# Altium schematic sheet eos26_motherboard_basic.SchDoc
size D
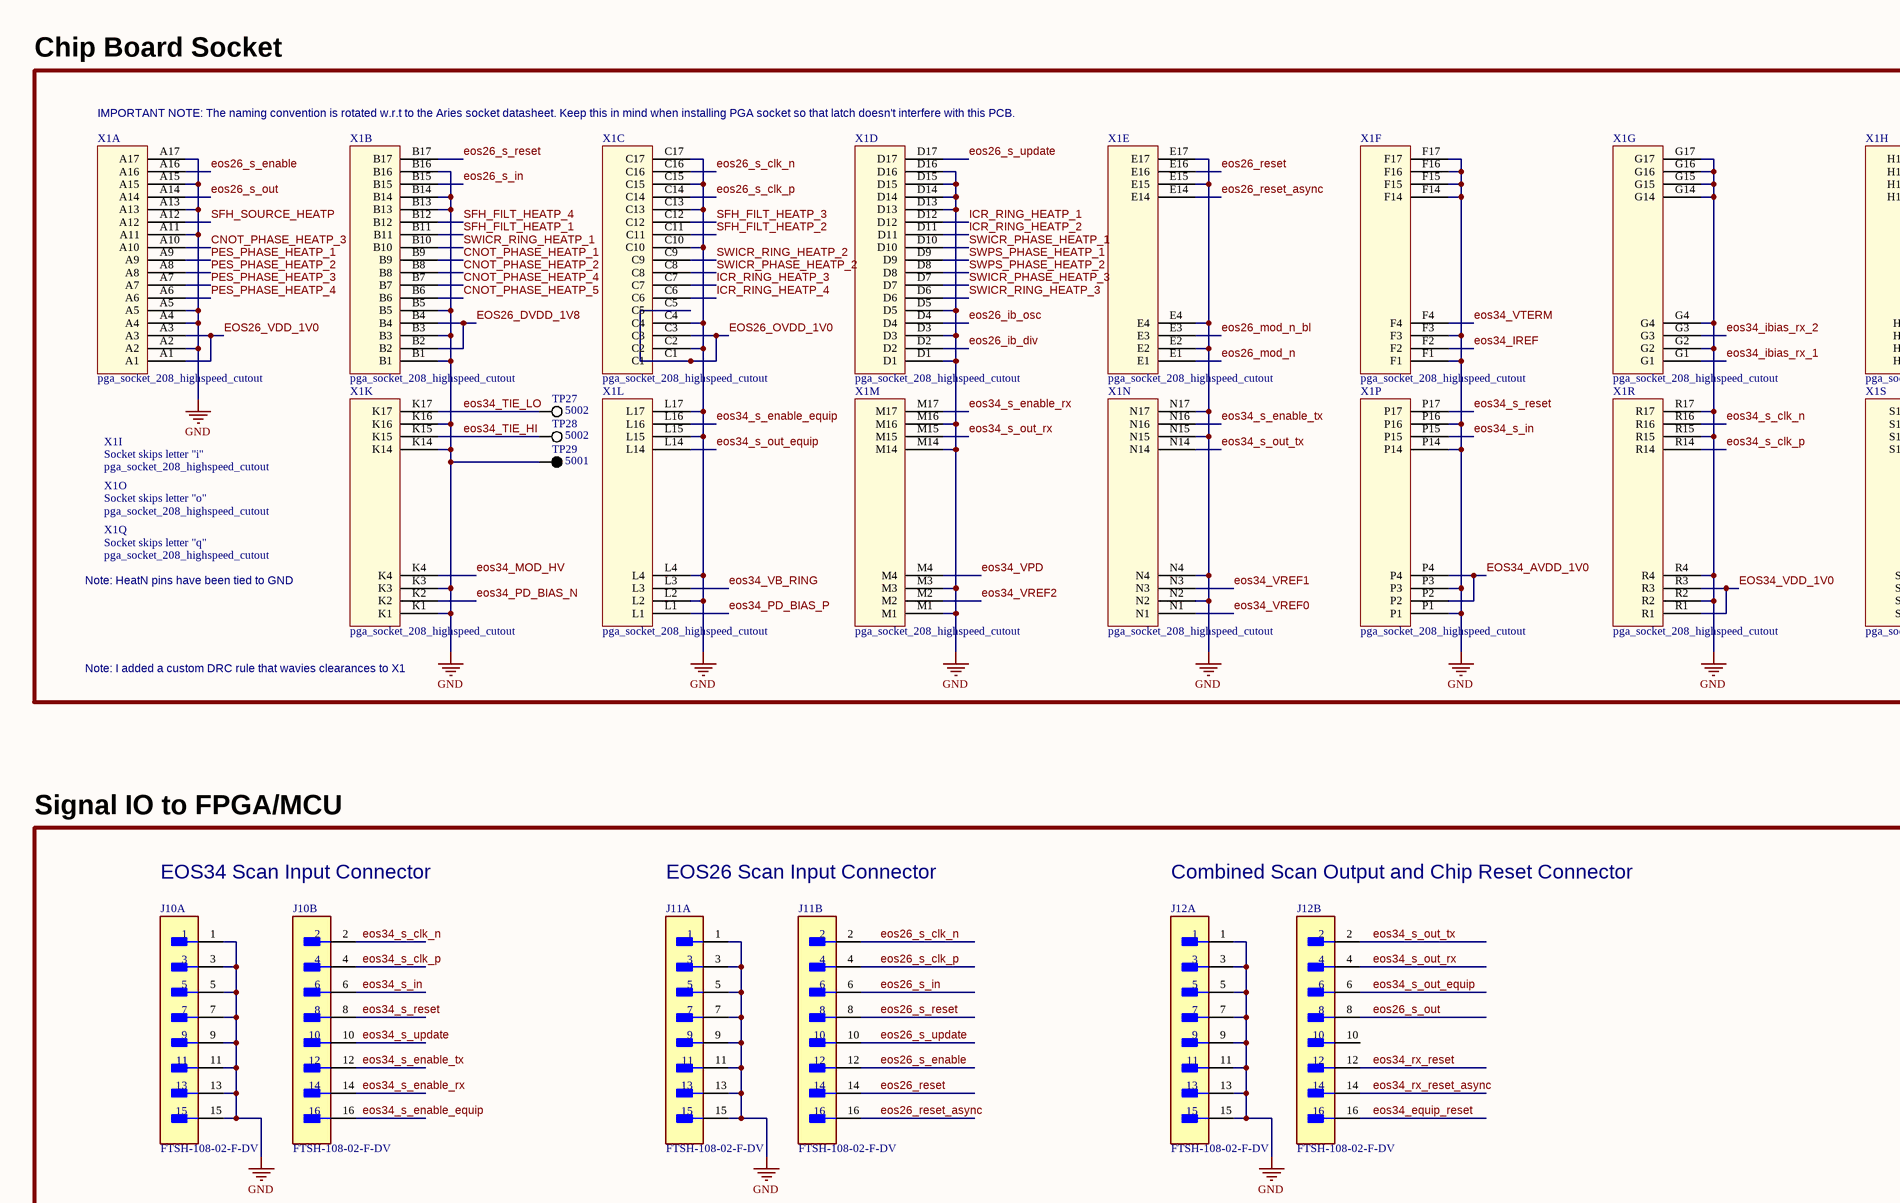
[diagram p0: eos26_motherboard_basic.SchDoc, top left]
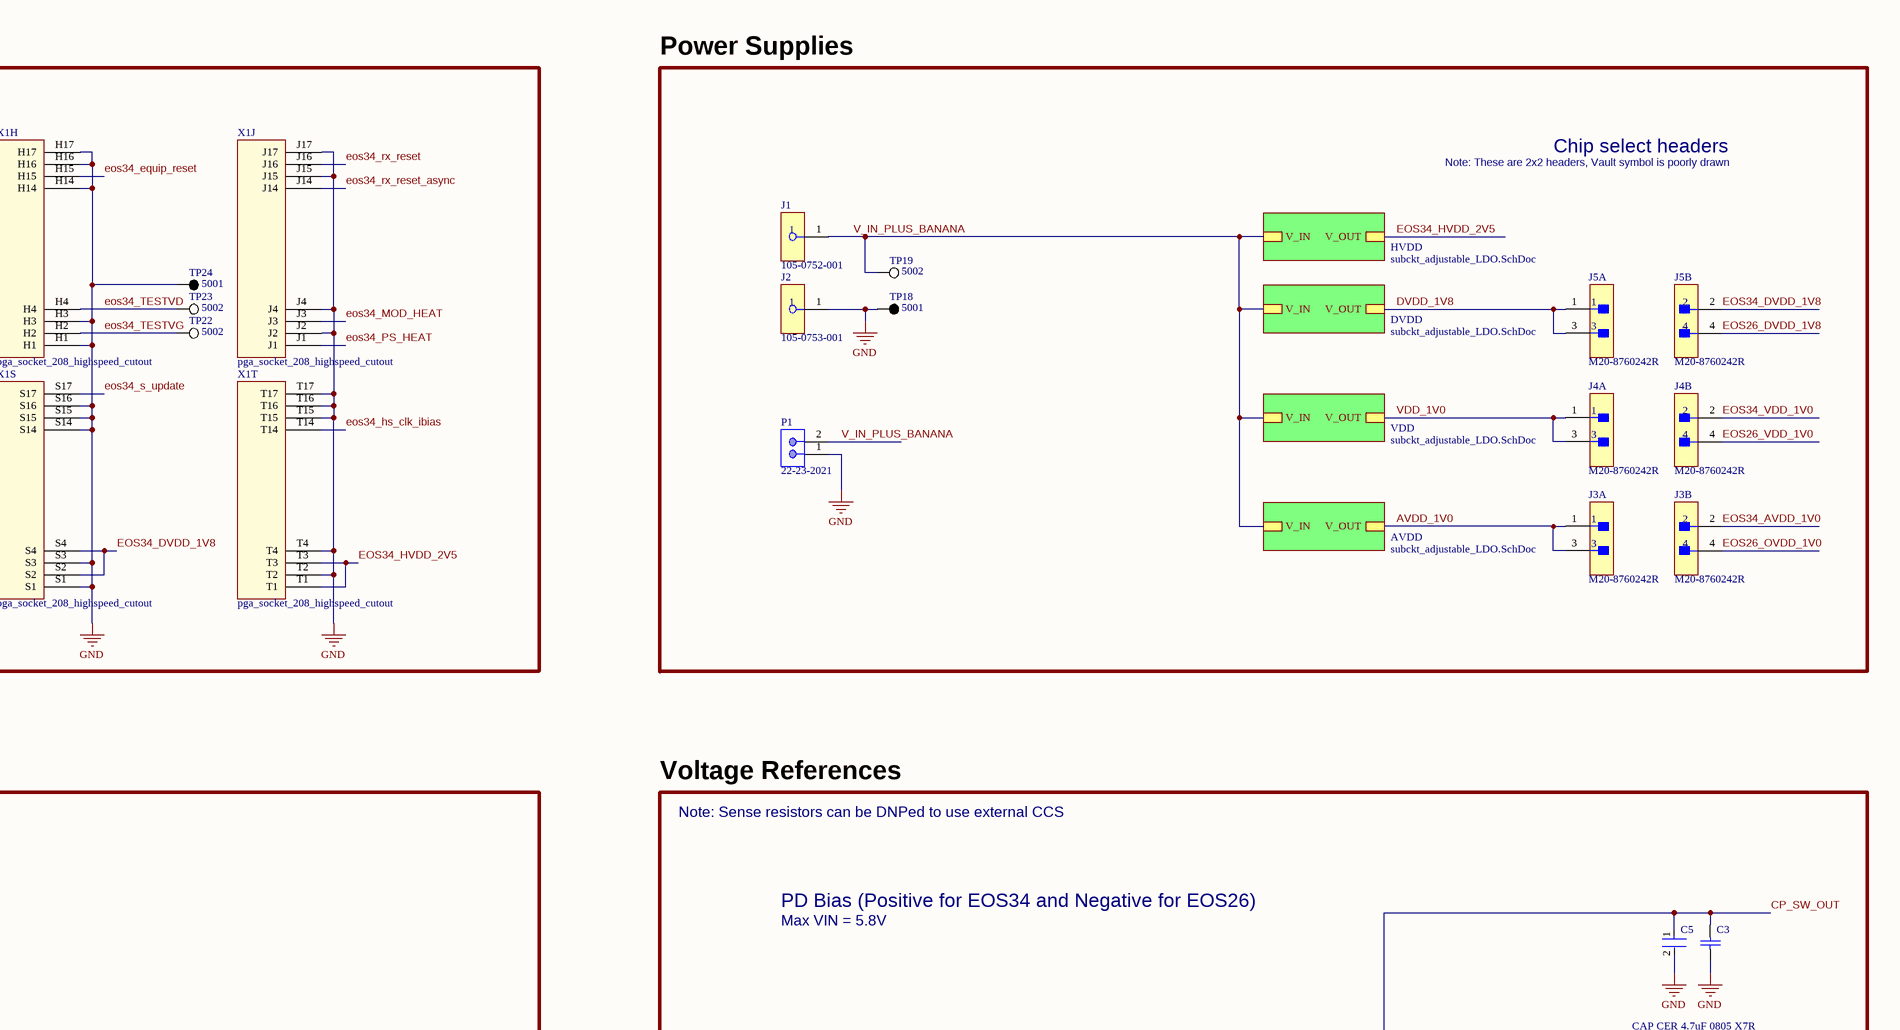
[diagram p1: eos26_motherboard_basic.SchDoc, top right]
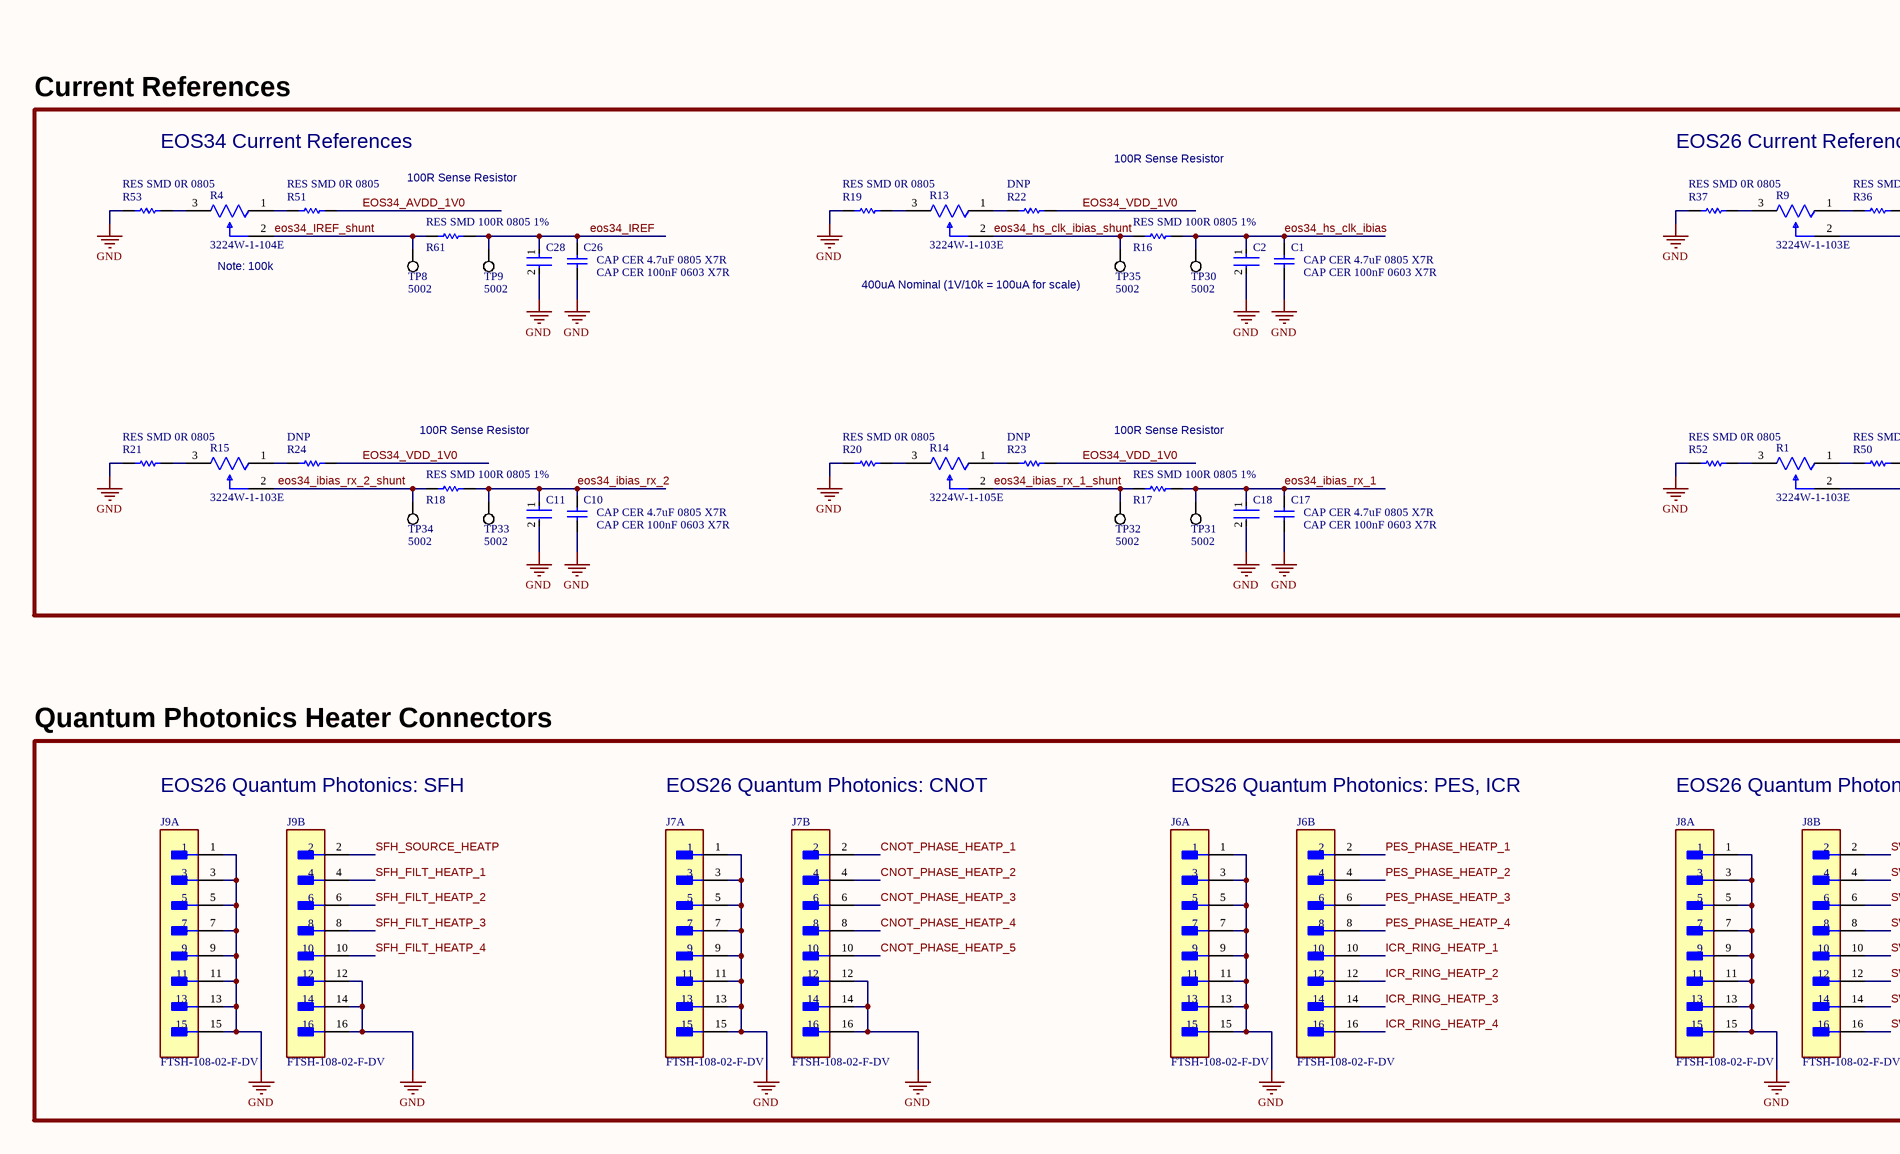
[diagram p2: eos26_motherboard_basic.SchDoc, bottom left]
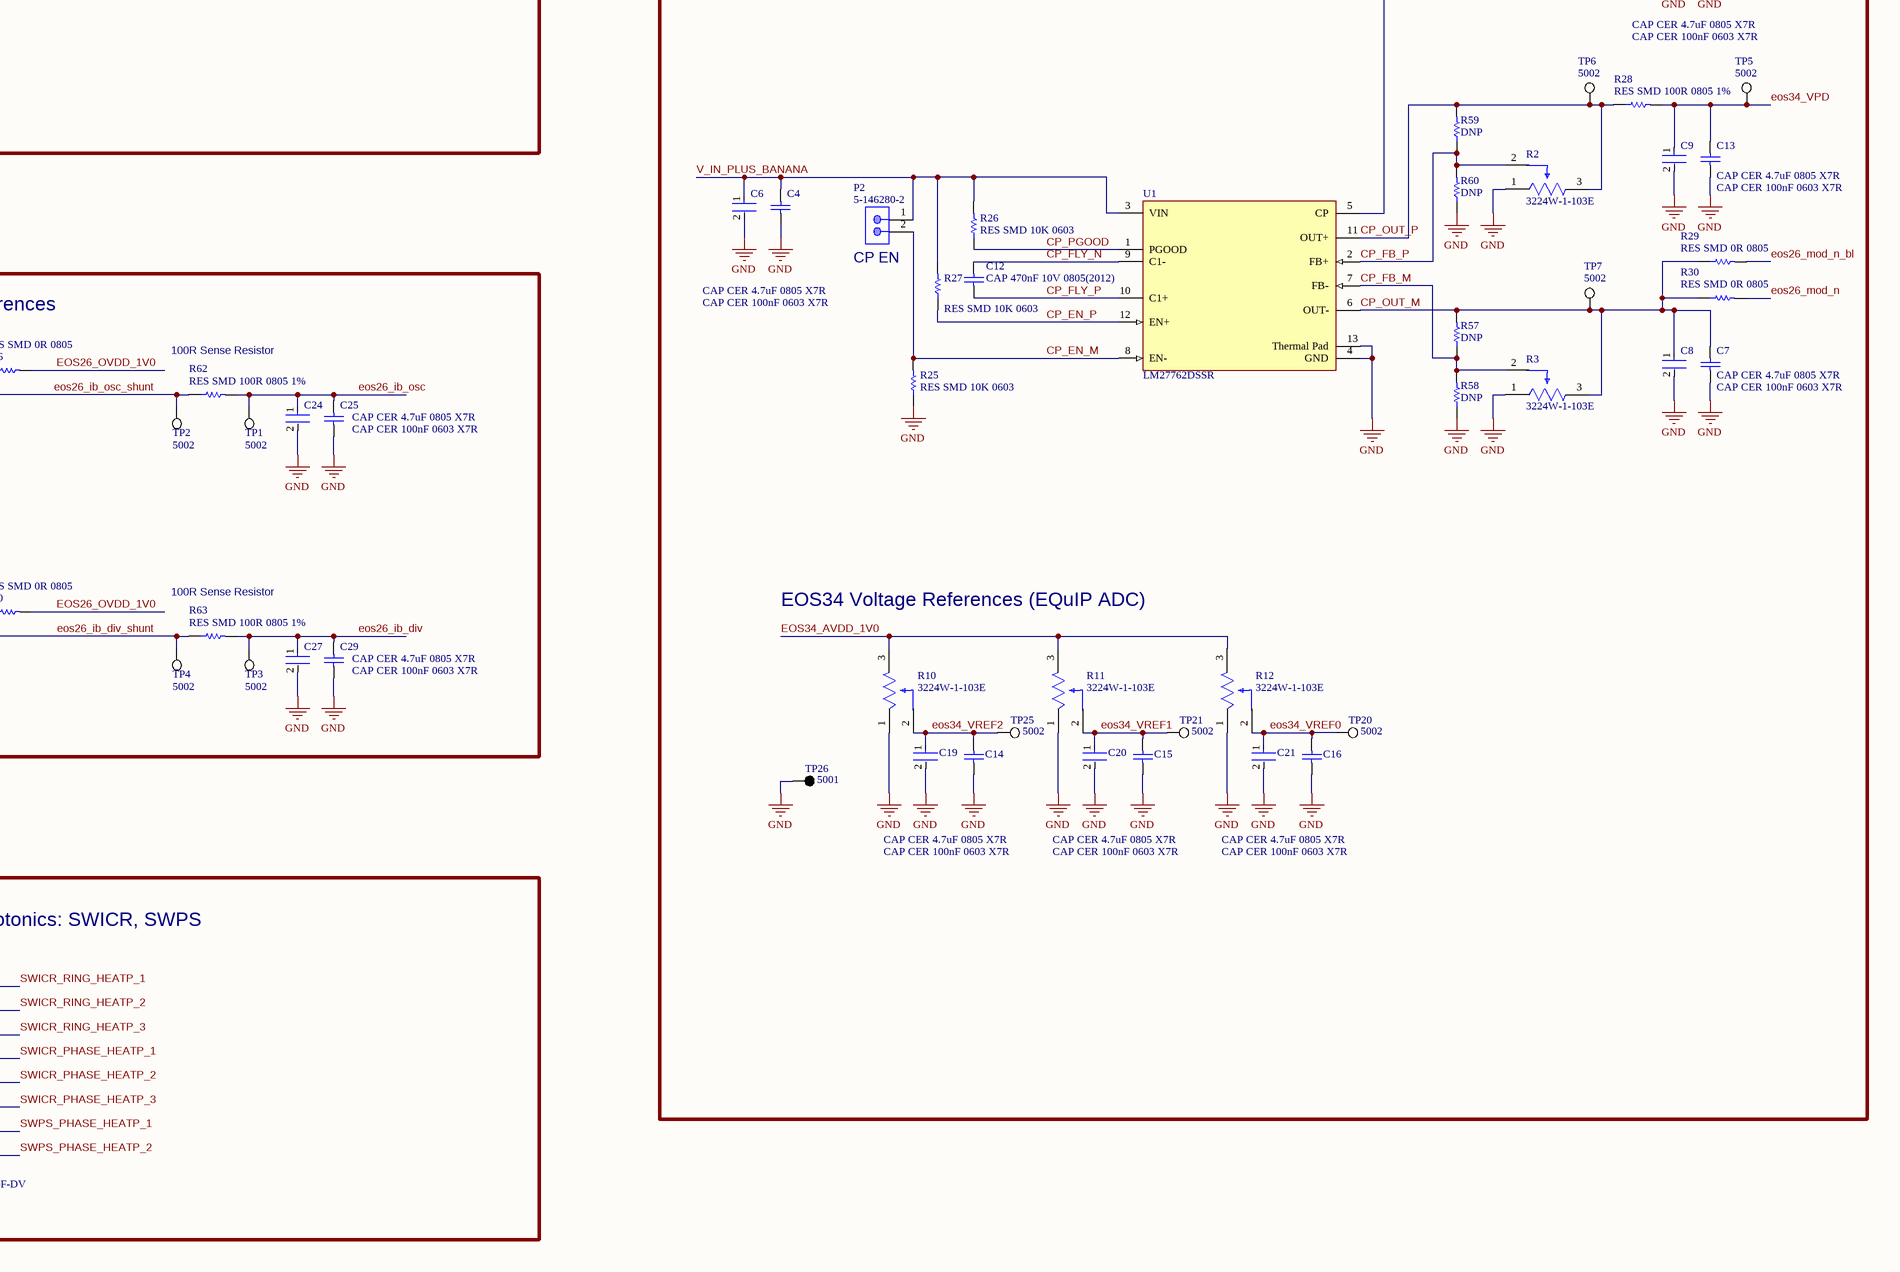
[diagram p3: eos26_motherboard_basic.SchDoc, bottom right]

## Parts
C1  CAP CER 4.7uF 0805 X7R  [CAPC2013X140X50NL20T25]
C2  CAP CER 100nF 0603 X7R  [FP-CC0603-DA-MFG]
C3  CAP CER 4.7uF 0805 X7R  [CAPC2013X140X50NL20T25]
C4  CAP CER 4.7uF 0805 X7R  [CAPC2013X140X50NL20T25]
C5  CAP CER 100nF 0603 X7R  [FP-CC0603-DA-MFG]
C6  CAP CER 100nF 0603 X7R  [FP-CC0603-DA-MFG]
C7  CAP CER 4.7uF 0805 X7R  [CAPC2013X140X50NL20T25]
C8  CAP CER 100nF 0603 X7R  [FP-CC0603-DA-MFG]
C9  CAP CER 100nF 0603 X7R  [FP-CC0603-DA-MFG]
C10  CAP CER 4.7uF 0805 X7R  [CAPC2013X140X50NL20T25]
C11  CAP CER 100nF 0603 X7R  [FP-CC0603-DA-MFG]
C12  CAP 470nF 10V 0805(2012)  [CAPC0805(2012)145_M]
C13  CAP CER 4.7uF 0805 X7R  [CAPC2013X140X50NL20T25]
C14  CAP CER 4.7uF 0805 X7R  [CAPC2013X140X50NL20T25]
C15  CAP CER 4.7uF 0805 X7R  [CAPC2013X140X50NL20T25]
C16  CAP CER 4.7uF 0805 X7R  [CAPC2013X140X50NL20T25]
C17  CAP CER 4.7uF 0805 X7R  [CAPC2013X140X50NL20T25]
C18  CAP CER 100nF 0603 X7R  [FP-CC0603-DA-MFG]
C19  CAP CER 100nF 0603 X7R  [FP-CC0603-DA-MFG]
C20  CAP CER 100nF 0603 X7R  [FP-CC0603-DA-MFG]
C21  CAP CER 100nF 0603 X7R  [FP-CC0603-DA-MFG]
C24  CAP CER 100nF 0603 X7R  [FP-CC0603-DA-MFG]
C25  CAP CER 4.7uF 0805 X7R  [CAPC2013X140X50NL20T25]
C26  CAP CER 4.7uF 0805 X7R  [CAPC2013X140X50NL20T25]
C27  CAP CER 100nF 0603 X7R  [FP-CC0603-DA-MFG]
C28  CAP CER 100nF 0603 X7R  [FP-CC0603-DA-MFG]
C29  CAP CER 4.7uF 0805 X7R  [CAPC2013X140X50NL20T25]
J1  105-0752-001  [FP-105-0751-001-MFG]
J2  105-0753-001  [FP-105-0751-001-MFG]
J3  M20-8760242R  [FP-M20-8760242R-MFG]  (parts A,B of 2)
J4  M20-8760242R  [FP-M20-8760242R-MFG]  (parts A,B of 2)
J5  M20-8760242R  [FP-M20-8760242R-MFG]  (parts A,B of 2)
J6  FTSH-108-02-F-DV  [LIBRARYSOURCE=Vault|VAULTGUID=B7D15EC3-160A-466F-A46C-7801FE6295A7|REVISIONGUID=4386816A-B426-492F-A73C-09950B70C106|FOOTPRINT=FP-FTSH-108-02-F-DV]  (parts A,B of 2)
J7  FTSH-108-02-F-DV  [LIBRARYSOURCE=Vault|VAULTGUID=B7D15EC3-160A-466F-A46C-7801FE6295A7|REVISIONGUID=4386816A-B426-492F-A73C-09950B70C106|FOOTPRINT=FP-FTSH-108-02-F-DV]  (parts A,B of 2)
J8  FTSH-108-02-F-DV  [LIBRARYSOURCE=Vault|VAULTGUID=B7D15EC3-160A-466F-A46C-7801FE6295A7|REVISIONGUID=4386816A-B426-492F-A73C-09950B70C106|FOOTPRINT=FP-FTSH-108-02-F-DV]  (parts A,B of 2)
J9  FTSH-108-02-F-DV  [LIBRARYSOURCE=Vault|VAULTGUID=B7D15EC3-160A-466F-A46C-7801FE6295A7|REVISIONGUID=4386816A-B426-492F-A73C-09950B70C106|FOOTPRINT=FP-FTSH-108-02-F-DV]  (parts A,B of 2)
J10  FTSH-108-02-F-DV  [LIBRARYSOURCE=Vault|VAULTGUID=B7D15EC3-160A-466F-A46C-7801FE6295A7|REVISIONGUID=4386816A-B426-492F-A73C-09950B70C106|FOOTPRINT=FP-FTSH-108-02-F-DV]  (parts A,B of 2)
J11  FTSH-108-02-F-DV  [LIBRARYSOURCE=Vault|VAULTGUID=B7D15EC3-160A-466F-A46C-7801FE6295A7|REVISIONGUID=4386816A-B426-492F-A73C-09950B70C106|FOOTPRINT=FP-FTSH-108-02-F-DV]  (parts A,B of 2)
J12  FTSH-108-02-F-DV  [LIBRARYSOURCE=Vault|VAULTGUID=B7D15EC3-160A-466F-A46C-7801FE6295A7|REVISIONGUID=4386816A-B426-492F-A73C-09950B70C106|FOOTPRINT=FP-FTSH-108-02-F-DV]  (parts A,B of 2)
P1  22-23-2021  [MOLX-22-23-2021_V]
P2  5-146280-2  [TECO-5-146280-2_V]
R1  3224W-1-103E  [FP-3224W-MFG]
R2  3224W-1-103E  [FP-3224W-MFG]
R3  3224W-1-103E  [FP-3224W-MFG]
R4  3224W-1-104E  [FP-3224W-MFG]
R9  3224W-1-103E  [FP-3224W-MFG]
R10  3224W-1-103E  [FP-3224W-MFG]
R11  3224W-1-103E  [FP-3224W-MFG]
R12  3224W-1-103E  [FP-3224W-MFG]
R13  3224W-1-103E  [FP-3224W-MFG]
R14  3224W-1-105E  [FP-3224W-MFG]
R15  3224W-1-103E  [FP-3224W-MFG]
R16  RES SMD 100R 0805 1%  [RESC2013X55X40NL15T20]
R17  RES SMD 100R 0805 1%  [RESC2013X55X40NL15T20]
R18  RES SMD 100R 0805 1%  [RESC2013X55X40NL15T20]
R19  RES SMD 0R 0805  [RESC2013X55X40NL15T20]
R20  RES SMD 0R 0805  [RESC2013X55X40NL15T20]
R21  RES SMD 0R 0805  [RESC2013X55X40NL15T20]
R22  DNP  [RESC2013X55X40NL15T20]
R23  DNP  [RESC2013X55X40NL15T20]
R24  DNP  [RESC2013X55X40NL15T20]
R25  RES SMD 10K 0603  [RESC1609X55X30LL15T15]
R26  RES SMD 10K 0603  [RESC1609X55X30LL15T15]
R27  RES SMD 10K 0603  [RESC1609X55X30LL15T15]
R28  RES SMD 100R 0805 1%  [RESC2013X55X40NL15T20]
R29  RES SMD 0R 0805  [RESC2013X55X40NL15T20]
R30  RES SMD 0R 0805  [RESC2013X55X40NL15T20]
R36  RES SMD 0R 0805  [RESC2013X55X40NL15T20]
R37  RES SMD 0R 0805  [RESC2013X55X40NL15T20]
R50  RES SMD 0R 0805  [RESC2013X55X40NL15T20]
R51  RES SMD 0R 0805  [RESC2013X55X40NL15T20]
R52  RES SMD 0R 0805  [RESC2013X55X40NL15T20]
R53  RES SMD 0R 0805  [RESC2013X55X40NL15T20]
R57  DNP  [RESC1608X55X30LL10T20_A]
R58  DNP  [RESC1608X55X30LL10T20_A]
R59  DNP  [RESC1608X55X30LL10T20_A]
R60  DNP  [RESC1608X55X30LL10T20_A]
R61  RES SMD 100R 0805 1%  [RESC2013X55X40NL15T20]
R62  RES SMD 100R 0805 1%  [RESC2013X55X40NL15T20]
R63  RES SMD 100R 0805 1%  [RESC2013X55X40NL15T20]
TP1  5002  [KSTN-5002]
TP2  5002  [KSTN-5002]
TP3  5002  [KSTN-5002]
TP4  5002  [KSTN-5002]
TP5  5002  [KSTN-5002]
TP6  5002  [KSTN-5002]
TP7  5002  [KSTN-5002]
TP8  5002  [KSTN-5002]
TP9  5002  [KSTN-5002]
TP18  5001  [KSTN-5001]
TP19  5002  [KSTN-5002]
TP20  5002  [KSTN-5002]
TP21  5002  [KSTN-5002]
TP22  5002  [KSTN-5002]
TP23  5002  [KSTN-5002]
TP24  5001  [KSTN-5001]
TP25  5002  [KSTN-5002]
TP26  5001  [KSTN-5001]
TP27  5002  [KSTN-5002]
TP28  5002  [KSTN-5002]
TP29  5001  [KSTN-5001]
TP30  5002  [KSTN-5002]
TP31  5002  [KSTN-5002]
TP32  5002  [KSTN-5002]
TP33  5002  [KSTN-5002]
TP34  5002  [KSTN-5002]
TP35  5002  [KSTN-5002]
U1  LM27762DSSR  [FP-DSS0012B-MFG]
X1  pga_socket_208_highspeed_cutout  [pga_socket_208pin_highspeed_cutout]  (parts A,B,C,D,E,F,G,H,I,J,K,L,M,N,O,P,Q,R,S,T of 20)

## Blocks framed on the sheet
Chip Board Socket: TP22-TP24 TP27-TP29 X1
Power Supplies: J1-J5 P1 TP18 TP19
Signal IO to FPGA/MCU: J10-J12
Voltage References: C3-C9 C12-C16 C19-C21 P2 R2 R3 R10-R12 R25-R30 R57-R60 TP5-TP7 TP20 TP21 TP25 TP26 U1
Current References: C1 C2 C10 C11 C17 C18 C24-C29 R1 R4 R9 R13-R24 R36 R37 R50-R53 R61-R63 TP1-TP4 TP8 TP9 TP30-TP35
Quantum Photonics Heater Connectors: J6-J9

## Sub-sheets
AVDD = subckt_adjustable_LDO.SchDoc: V_IN, V_OUT
DVDD = subckt_adjustable_LDO.SchDoc: V_IN, V_OUT
HVDD = subckt_adjustable_LDO.SchDoc: V_IN, V_OUT
VDD = subckt_adjustable_LDO.SchDoc: V_IN, V_OUT

## Nets
GND: C1.2 C2.2 C3.2 C4.2 C5.2 C6.2 C7.2 C8.2 C9.2 C10.2 C11.2 C13.2 C14.2 C15.2 C16.2 C17.2 C18.2 C19.2 C20.2 C21.2 C24.2 C25.2 C26.2 C27.2 C28.2 C29.2 J2.1 J6.1 J6.3 J6.5 J6.7 J6.9 J6.11 J6.13 J6.15 J7.1 J7.3 J7.5 J7.7 J7.9 J7.11 J7.12 J7.13 J7.14 J7.15 J7.16 J8.1 J8.3 J8.5 J8.7 J8.9 J8.11 J8.13 J8.15 J9.1 J9.3 J9.5 J9.7 J9.9 J9.11 J9.12 J9.13 J9.14 J9.15 J9.16 J10.1 J10.3 J10.5 J10.7 J10.9 J10.11 J10.13 J10.15 J11.1 J11.3 J11.5 J11.7 J11.9 J11.11 J11.13 J11.15 J12.1 J12.3 J12.5 J12.7 J12.9 J12.11 J12.13 J12.15 P1.1 R2.1(CCW) R3.1(CCW) R10.1(CCW) R11.1(CCW) R12.1(CCW) R19.1 R20.1 R21.1 R25.1 R37.1 R52.1 R53.1 R58.1 R60.1 TP18.1 TP24.1 TP26.1 TP29.1 U1.4(GND) U1.13(Thermal_Pad) X1.A2 X1.A4 X1.A5 X1.A11 X1.A13 X1.A15 X1.A17 X1.B1 X1.B3 X1.B5 X1.B13 X1.B14 X1.B16 X1.C2 X1.C4 X1.C10 X1.C13 X1.C15 X1.C17 X1.D1 X1.D3 X1.D5 X1.D13 X1.D14 X1.D15 X1.D16 X1.E2 X1.E4 X1.E15 X1.E17 X1.F1 X1.F3 X1.F14 X1.F15 X1.F16 X1.F17 X1.G2 X1.G4 X1.G14 X1.G15 X1.G16 X1.G17 X1.H1 X1.H3 X1.H14 X1.H16 X1.H17 X1.J2 X1.J4 X1.J15 X1.J17 X1.K1 X1.K3 X1.K14 X1.K16 X1.L2 X1.L4 X1.L15 X1.L17 X1.M1 X1.M3 X1.M14 X1.M16 X1.N2 X1.N4 X1.N15 X1.N17 X1.P1 X1.P3 X1.P14 X1.P16 X1.R2 X1.R4 X1.R15 X1.R17 X1.S1 X1.S3 X1.S14 X1.S15 X1.S16 X1.T2 X1.T4 X1.T15 X1.T16 X1.T17
AVDD_1V0: J3.1 J3.3 ; sheet AVDD/V_OUT
CNOT_PHASE_HEATP_1: J7.2 X1.B9
CNOT_PHASE_HEATP_2: J7.4 X1.B8
CNOT_PHASE_HEATP_3: J7.6 X1.A10
CNOT_PHASE_HEATP_4: J7.8 X1.B7
CNOT_PHASE_HEATP_5: J7.10 X1.B6
CP_EN_M: P2.2 R25.2 U1.8(EN-)
CP_EN_P: R27.1 U1.12(EN+)
CP_FB_M: R3.2(WIPER) R57.1 R58.2 U1.7(FB-)
CP_FB_P: R2.2(WIPER) R59.1 R60.2 U1.2(FB+)
CP_FLY_N: C12.2 U1.9(C1-)
CP_FLY_P: C12.1 U1.10(C1+)
CP_OUT_M: C7.1 C8.1 R3.3(CW) R29.1 R30.1 R57.2 TP7.1 U1.6(OUT-)
CP_OUT_P: R2.3(CW) R28.1 R59.2 TP6.1 U1.11(OUT+)
CP_PGOOD: R26.1 U1.1(PGOOD)
CP_SW_OUT: C3.1 C5.1 U1.5(CP)
DVDD_1V8: J5.1 J5.3 ; sheet DVDD/V_OUT
EOS26_DVDD_1V8: J5.4 X1.B2 X1.B4
eos26_ib_div: C27.1 C29.1 R63.2 TP3.1 X1.D2
eos26_ib_div_shunt: R1.2(WIPER) R63.1 TP4.1
eos26_ib_osc: C24.1 C25.1 R62.2 TP1.1 X1.D4
eos26_ib_osc_shunt: R9.2(WIPER) R62.1 TP2.1
eos26_mod_n: R30.2 X1.E1
eos26_mod_n_bl: R29.2 X1.E3
EOS26_OVDD_1V0: J3.4 R36.2 R50.2 X1.C1 X1.C3 X1.C5
eos26_reset: J11.14 X1.E16
eos26_reset_async: J11.16 X1.E14
eos26_s_clk_n: J11.2 X1.C16
eos26_s_clk_p: J11.4 X1.C14
eos26_s_enable: J11.12 X1.A16
eos26_s_in: J11.6 X1.B15
eos26_s_out: J12.8 X1.A14
eos26_s_reset: J11.8 X1.B17
eos26_s_update: J11.10 X1.D17
EOS26_VDD_1V0: J4.4 X1.A1 X1.A3
EOS34_AVDD_1V0: J3.2 R10.3(CW) R11.3(CW) R12.3(CW) R51.2 X1.P2 X1.P4
EOS34_DVDD_1V8: J5.2 X1.S2 X1.S4
eos34_equip_reset: J12.16 X1.H15
eos34_hs_clk_ibias: C1.1 C2.1 R16.2 TP30.1 X1.T14
eos34_hs_clk_ibias_shunt: R13.2(WIPER) R16.1 TP35.1
EOS34_HVDD_2V5: X1.T1 X1.T3 ; sheet HVDD/V_OUT
eos34_ibias_rx_1: C17.1 C18.1 R17.2 TP31.1 X1.G1
eos34_ibias_rx_1_shunt: R14.2(WIPER) R17.1 TP32.1
eos34_ibias_rx_2: C10.1 C11.1 R18.2 TP33.1 X1.G3
eos34_ibias_rx_2_shunt: R15.2(WIPER) R18.1 TP34.1
eos34_IREF: C26.1 C28.1 R61.2 TP9.1 X1.F2
eos34_IREF_shunt: R4.2(WIPER) R61.1 TP8.1
eos34_MOD_HEAT: X1.J3
eos34_MOD_HV: X1.K4
eos34_PD_BIAS_N: X1.K2
eos34_PD_BIAS_P: X1.L1
eos34_PS_HEAT: X1.J1
eos34_rx_reset: J12.12 X1.J16
eos34_rx_reset_async: J12.14 X1.J14
eos34_s_clk_n: J10.2 X1.R16
eos34_s_clk_p: J10.4 X1.R14
eos34_s_enable_equip: J10.16 X1.L16
eos34_s_enable_rx: J10.14 X1.M17
eos34_s_enable_tx: J10.12 X1.N16
eos34_s_in: J10.6 X1.P15
eos34_s_out_equip: J12.6 X1.L14
eos34_s_out_rx: J12.4 X1.M15
eos34_s_out_tx: J12.2 X1.N14
eos34_s_reset: J10.8 X1.P17
eos34_s_update: J10.10 X1.S17
eos34_TESTVD: TP23.1 X1.H4
eos34_TESTVG: TP22.1 X1.H2
eos34_TIE_HI: TP28.1 X1.K15
eos34_TIE_LO: TP27.1 X1.K17
eos34_VB_RING: X1.L3
EOS34_VDD_1V0: J4.2 R22.2 R23.2 R24.2 X1.R1 X1.R3
eos34_VPD: C9.1 C13.1 R28.2 TP5.1 X1.M4
eos34_VREF0: C16.1 C21.1 R12.2(WIPER) TP20.1 X1.N1
eos34_VREF1: C15.1 C20.1 R11.2(WIPER) TP21.1 X1.N3
eos34_VREF2: C14.1 C19.1 R10.2(WIPER) TP25.1 X1.M2
eos34_VTERM: X1.F4
ICR_RING_HEATP_1: J6.10 X1.D12
ICR_RING_HEATP_2: J6.12 X1.D11
ICR_RING_HEATP_3: J6.14 X1.C7
ICR_RING_HEATP_4: J6.16 X1.C6
PES_PHASE_HEATP_1: J6.2 X1.A9
PES_PHASE_HEATP_2: J6.4 X1.A8
PES_PHASE_HEATP_3: J6.6 X1.A7
PES_PHASE_HEATP_4: J6.8 X1.A6
SFH_FILT_HEATP_1: J9.4 X1.B11
SFH_FILT_HEATP_2: J9.6 X1.C11
SFH_FILT_HEATP_3: J9.8 X1.C12
SFH_FILT_HEATP_4: J9.10 X1.B12
SFH_SOURCE_HEATP: J9.2 X1.A12
SWICR_PHASE_HEATP_1: J8.8 X1.D10
SWICR_PHASE_HEATP_2: J8.10 X1.C8
SWICR_PHASE_HEATP_3: J8.12 X1.D7
SWICR_RING_HEATP_1: J8.2 X1.B10
SWICR_RING_HEATP_2: J8.4 X1.C9
SWICR_RING_HEATP_3: J8.6 X1.D6
SWPS_PHASE_HEATP_1: J8.14 X1.D9
SWPS_PHASE_HEATP_2: J8.16 X1.D8
V_IN_PLUS_BANANA: C4.1 C6.1 J1.1 P1.2 P2.1 R26.2 R27.2 TP19.1 U1.3(VIN) ; sheet DVDD/V_IN, sheet VDD/V_IN, sheet AVDD/V_IN, sheet HVDD/V_IN
VDD_1V0: J4.1 J4.3 ; sheet VDD/V_OUT
NetR1_1: R1.1(CCW) R50.1
NetR1_3: R1.3(CW) R52.2
NetR4_1: R4.1(CCW) R51.1
NetR4_3: R4.3(CW) R53.2
NetR9_1: R9.1(CCW) R36.1
NetR9_3: R9.3(CW) R37.2
NetR13_1: R13.1(CCW) R22.1
NetR13_3: R13.3(CW) R19.2
NetR14_1: R14.1(CCW) R23.1
NetR14_3: R14.3(CW) R20.2
NetR15_1: R15.1(CCW) R24.1
NetR15_3: R15.3(CW) R21.2

Not connected (* = marked no-connect by the designer): J12 10

## Notes on the sheet
- (near X1) IMPORTANT NOTE: The naming convention is rotated w.r.t to the Aries socket datasheet. Keep this in mind when installing PGA socket so that latch doesn't interfere with this PCB.
- Note: These are 2x2 headers, Vault symbol is poorly drawn
- Chip select headers
- (near X1) Note: HeatN pins have been tied to GND
- Note: I added a custom DRC rule that wavies clearances to X1
- Note: Sense resistors can be DNPed to use external CCS
- EOS34 Scan Input Connector
- EOS26 Scan Input Connector
- Combined Scan Output and Chip Reset Connector
- PD Bias (Positive for EOS34 and Negative for EOS26)
- Max VIN = 5.8V
- (near P2) CP EN
- EOS34 Current References
- 100R Sense Resistor
- EOS26 Current References
- (near R62) 100R Sense Resistor
- (near R4) Note: 100k
- 400uA Nominal (1V/10k = 100uA for scale)
- (near R63) 100R Sense Resistor
- EOS34 Voltage References (EQuIP ADC)
- EOS26 Quantum Photonics: SFH
- EOS26 Quantum Photonics: CNOT
- EOS26 Quantum Photonics: PES, ICR
- EOS26 Quantum Photonics: SWICR, SWPS
- (in symbol pga_socket_208_highspeed_cutout, part I) Socket skips letter "i"
- (in symbol pga_socket_208_highspeed_cutout, part O) Socket skips letter "o"
- (in symbol pga_socket_208_highspeed_cutout, part Q) Socket skips letter "q"

## Library data of the parts
C1 C3 C4 C7 C10 C13-C17 C25 C26 C29 = CMP-2007-04677-1: Part Number: 0805ZC475KAT2A; Manufacturer: AVX Interconnect / Elco
C2 C5 C6 C8 C9 C11 C18-C21 C24 C27 C28 = CMP-03422-000030-1: CAP CER 0.1UF 16V X7R 0603; Manufacturer Part Number: CC0603KRX7R7BB104; Manufacturer: YAGEO; Tolerance: 0.1; Temperature Coefficient: 15%; Material: Ceramic; Voltage Rating: 16 V; Package: CC0603-DA; ComponentLink2Description: Datasheet; Octopart: https://octopart.com/cc0603krx7r7bb104-yageo-192941; Temperature Range High: +125°C; Digikey Description: CAP CER 0.1UF 16V X7R 0603; Value: 100 nF; Voltage: 16 V; Device Class L2: Capacitors; Height: 0.9mm; Temperature: -55°C to +125°C; Device Class L1: Passive Components; Device Class L3: Ceramic Capacitors; ComponentLink2URL: http://www.yageo.com/documents/recent/UPY-GPHC_X7R_6.3V-to-50V_18.pdf; Footprint Url: http://www.yageo.com/exep/pages/download/literatures/UPY-C_GEN_24.pdf; RoHS: TRUE; Temperature Range Low: -55°C; Temperature Characteristic: X7R; Lead Free: Yes; Capacitance: 100 nF; Category: Cap; Mouser Description: Multilayer Ceramic Capacitor, CC Series, 0.1 - F, - 10%, X7R, 16 V, 0603 [1608 Metric]; Automotive: No
C12 = CMP-1036-04629-1: CAP 470nF 10V ±5% 0805 (2012 Metric) Thickness 1.45mm SMD; Case-EIA: 0805; Case-Metric: 2012; Tolerance: Â±5%; Max Thickness: 1.45 mm; Rated Voltage: 10 V; Technology: SMT; Value: 470nF
J1 J2 = CMP-09586-000001-1: CONN TIP JACK SOLDER WHITE; Manufacturer: Cinch Connectivity; Manufacturer Part Number: 105-0751-001; Current Rating: 5A; Number Of Contacts: 1; Conn Orientation: Horizontal; Pitch: 10.16mm; Voltage Rating: 1500V; Is Female: yes; ComponentLink2URL: https://belfuse.com/resources/Johnson/drawings/dr-1050751001.pdf; RoHS: TRUE; ComponentLink2Description: Datasheet; Automotive: No; Temperature Range Low: -55°C; Digikey Description: CONN TIP JACK SOLDER WHITE; Device Class L2: unset; Octopart: https://octopart.com/105-0751-001-cinch+connectivity+solutions-51372833; Lead Free: Yes; Package: 105-0751-001; Device Class L3: unset; Contact Material: Silver; Temperature Range High: +75°C; Device Class L1: Connectors; Category: Conn; Height: 0.213inch; Temperature: -55°C to +75°C
J3-J5 = CMP-15831-000023-1: CONN HEADER SMD 4POS 2.54MM; Connector Type: Male Pin; Number of Positions: 4; Max Current Rating: 3A; Gender: Male; Row Spacing: 0.1inch; Contact Resistance: 20mR; Max Voltage Rating (AC): 250V; Max Operating Temperature: 105°C; Housing Material: Nylon; Termination: Solder; Pitch: 2.54mm; Contact Plating: Gold; Mount: Surface Mount; Color: Black; Contact Mating Length: 0.228inch; Length: 5.08mm; Number of Rows: 2; Orientation: Straight; Package Quantity: 350; Contact Material: Brass; Min Operating Temperature: -40°C; Housing Color: Black; Depth: 7.2mm; Packaging: Tape and Reel
J6-J12 = FP-FTSH-108-02-F-DV: CONN HEADER SMD 16POS 1.27MM; Manufacturer: Samtec; Standoff Height: 0.46mm; Conn Orientation: Vertical; Current Rating: 3.4A; Number Of Contacts: 16; Conn Gender: Male; Lead Free: Yes; Package: FTSH-108-02-F-DV; Footprint Url: http://suddendocs.samtec.com/prints/ftsh-1xx-xx-xxx-dv-xxx-footprint.pdf; Automotive: No; Pitch: 1.27mm; Manufacturer Part Number: FTSH-108-02-F-DV; Device Class L2: Headers and Wire Housings; ComponentLink2URL: http://suddendocs.samtec.com/prints/ftsh-1xx-xx-xxx-dv-xxx-xxx-mkt.pdf; ComponentLink2Description: Datasheet; Octopart: https://octopart.com/ftsh-108-02-f-dv-samtec-10605893; RoHS: TRUE; Digikey Description: CONN HEADER SMD 16POS 1.27MM; Device Class L1: Connectors; Temperature Range High: +125°C; Temperature: -55°C to +125°C; Device Class L3: unset; Category: Conn; Temperature Range Low: -55°C; Number Of Rows: 2; Contact Material: Gold,Nickel; Mouser Description: Conn Unshrouded Header HDR 16 POS 1.27mm Solder ST SMD Tube; Height: 5.09mm
P1 = CMP-1704-00001-3: Male Header, Pitch 2.54 mm, 1 x 2 Position, Height 10.67 mm, Tail Length 3.56 mm, 0 to 75 degC, RoHS, Bulk; Package Quantity: 3000; Height: 10.67 mm; RoHSCompliant: True; ComponentLink2URL: https://datasheet.ciiva.com/19454/232266-19454304.pdf; PartNumber: 22-23-2021; Packaging: Bulk; ComponentLink2Description: Datasheet; Min Operating Temperature: 0 degC; ComponentLink1Description: Manufacturer URL; Length: 5.08 mm; Mounting Technology: Through Hole; Max Operating Temperature: 75 degC; REACH SVHC: Unknown; PackageDescription: Male Header, Pitch 2.54 mm, 1 x 2 Position, Height 10.67 mm, Tail Length 3.56 mm; ComponentLink1URL: http://www.molex.com/; Mount: Through Hole; Radiation Hardening: No; Width: 6.35 mm; Pins: 2
P2 = CMP-2000-07492-1: Male Header, Pitch 2.54 mm, 1 x 2 Position, Height 8.21 mm, Tail Length 3.05 mm, -65 to 105 degC, RoHS, Bulk; Manufacturer: TE Connectivity; Mating Connector Lock: No(Without); Number of Positions: 2; Pitch: 2.54mm; PCB Mounting Orientation: Vertical; Keyed: No; Case\/Package: 100; Mating Post Length: 0.23inch; High Temperature Housing: Yes; Max Current Rating: 5A; PCB Thickness: 0.063inch; PCB Mount Retention: Without; Approvals: CSA; Current Rating: 3A; Radiation Hardening: No; Length: 4.67mm; Contact Mating Length: 0.23inch; Connector Type: Header; Number of Rows: 1; Termination Post Length: 0.12inch; Board Standoff: No(Without); Max Operating Temperature: 105degC; Contact Shape: Square; Selectively Loaded: No(Without); Gasket: No(Without); Number of Contacts: 2; Contact Gender: Male; Mating Alignment: No(Without); Manufacturer URL: http://www.te.com/; Datasheet URL: http://www.te.com/commerce/DocumentDelivery/DDEController?Action=showdoc&DocId=Customer+Drawing%7F146280%7FH1%7Fpdf%7FEnglish%7FENG_CD_146280_H1.pdf%7F5-146280-2; Mount: ThroughHole; Orientation: Straight; Packaging: Carton; Package Reference: 5-146280-2; Package Quantity: 500; Stabilizers: No(Without); Row Spacing: 2.54mm; Contact Material: CopperAlloy; Panel Mount Retention: No(Without); Datasheet Version: Rev. H1, 08/2016; Housing Colour: Black; Colour: Black; Package Description: Male Header, Pitch 2.54 mm, 1 x 2 Position, Height 8.21 mm, Tail Length 3.05 mm; Contact Plating: Matte; Housing Material: Polymer; Contact Protection: No(Without); Min Operating Temperature: -65degC; Mounting Technology: ThroughHole; Flammability Rating: UL94V-0; RoHSCompliant: true; Termination: ThroughHole; Depth: 2.34mm; High Speed Serial Data Connector: No
R1-R3 R9-R13 R15 = CMP-07234-000002-1: TRIMMER 10K OHM 0.25W J LEAD TOP; Manufacturer: Bourns; Tolerance: 10%; Resistance: 10kΩ; Temperature Coefficient: 100ppm/°C; Value: 10kΩ; Standoff Height: 0.2mm; Voltage Rating: 300V; Power Rating: 250mW; Device Class L3: Variable Resistors and Potentiometers; Composition: Cermet; Temperature Range Low: -65°C; Package: 3224W; ComponentLink2Description: Datasheet; Digikey Description: TRIMMER 10K OHM 0.25W J LEAD TOP; Category: Res; Mouser Description: Trimmer Resistors - SMD 4mm 10Kohms 10% Square Cermet Sealed; Temperature: -65°C to +150°C; Device Class L2: Resistors; Device Class L1: Passive Components; RoHS: TRUE; Temperature Range High: +150°C; Manufacturer Part Number: 3224W-1-103E; ComponentLink2URL: https://upverter.com/datasheet/a166fca85da25564670351d2dc712345c058bc40.pdf; Series: 3224; Height: 5.55mm; Lead Free: Yes; Octopart: https://octopart.com/3224w-1-103e-bourns-14818; Automotive: No
R4 R14 = CMP-07234-000002-1: TRIMMER 10K OHM 0.25W J LEAD TOP; Manufacturer: Bourns; Manufacturer Part Number: 3224W-1-103E; Tolerance: 10%; Resistance: 10kΩ; Temperature Coefficient: 100ppm/°C; Value: 10kΩ; Standoff Height: 0.2mm; Voltage Rating: 300V; Power Rating: 250mW; Device Class L3: Variable Resistors and Potentiometers; Composition: Cermet; Temperature Range Low: -65°C; Package: 3224W; ComponentLink2Description: Datasheet; Digikey Description: TRIMMER 10K OHM 0.25W J LEAD TOP; Category: Res; Mouser Description: Trimmer Resistors - SMD 4mm 10Kohms 10% Square Cermet Sealed; Temperature: -65°C to +150°C; Device Class L2: Resistors; Device Class L1: Passive Components; RoHS: TRUE; Temperature Range High: +150°C; ComponentLink2URL: https://upverter.com/datasheet/a166fca85da25564670351d2dc712345c058bc40.pdf; Series: 3224; Height: 5.55mm; Lead Free: Yes; Octopart: https://octopart.com/3224w-1-103e-bourns-14818; Automotive: No
R16-R24 R28-R30 R36 R37 R50-R53 R61-R63 = CMP-2001-04723-1: Manufacturer: Vishay Dale; Part Number: TNPW0805100RBEEA
R25-R27 = CMP-2000-07452-1: Chip Resistor, 10 KOhm, +/- 1%, 0.1 W, -55 to 155 degC, 0603 (1608 Metric), RoHS, Tape and Reel; Manufacturer: Panasonic; Voltage Rating: 75V; Case\/Package: 0603; Power Rating: 100mW; Resistance: 10KOhm; Temperature Coefficient: 100ppm\/degreesC; Number of Pins: 2; Package Reference: 603; Depth: 0.8mm; Mount: SurfaceMount; Package Description: 2-Pin Surface Mount Device, Body 1.6 x 0.85 mm; Datasheet Version: 02/2017; Length: 1.6mm; Lead Free: LeadFree; Height: 0.45mm; Number of Terminations: 2; Max Power Dissipation: 100mW; Min Operating Temperature: -55degC; Datasheet URL: https://industrial.panasonic.com/cdbs/www-data/pdf/RDA0000/AOA0000C304.pdf; Termination: SMD/SMT; Case Code (Metric): 1608; Case Code (Imperial): 0603; Tolerance: 1%; Max Operating Temperature: 155degC; RoHSCompliant: true; Voltage Rating (DC): 75V; Radiation Hardening: No; Packaging: TapeandReel; Composition: ThickFilm; Mounting Technology: SurfaceMount; Manufacturer URL: http://www.panasonic.com/; Width: 0.031inch; REACH SVHC: NoSVHC; Contact Plating: Tin; Military Standard: Not; Package Quantity: 1
R57-R60 = CMP-2000-06686-1: Chip Resistor, 0 Ohm, +/- 5%, 100 mW, -55 to 155 degC, 0603 (1608 Metric), RoHS, Tape and Reel; Manufacturer: Rohm; Tolerance: Jumper; Power (Watts): 0.1W,1/10W; Resistance (Ohms): 0.0; Online Catalog: MCR03Series; EDA / CAD Models: DownloadfromAcceleratedDesigns; Other Names: RHM0.0CGTR; Series: MCR; Package Description: 2-Pin Surface Mount Device, Body 1.60 x 0.80 mm; Composition: ThickFilm; Height: 0.022"(0.55mm); Mounting Technology: SurfaceMount; Family: ChipResistor-SurfaceMount; Temperature Coefficient: -; Category: Resistors; Supplier Device Package: 0603(1608Metric); Package Reference: 0603; Size / Dimension: 0.063"Lx0.031"W(1.60mmx0.80mm); Standard Package: 5,000; Datasheet URL: http://www.rohm.com/web/global/datasheet/MCR03ERTJ; Features: -; Datasheet Version: Rev. F, 02/2015; Operating Temperature: -55°C~155°C; Package / Case: 0603(1608Metric); Manufacturer URL: http://www.rohm.com/web/global/; Packaging: Tape&Reel(TR); Number of Terminations: 2
TP1-TP9 TP19-TP23 TP25 TP27 TP28 TP30-TP35 = CMP-2000-05182-1: Test Point, White, 1-Pin THD, RoHS, Bulk; Manufacturer: KeystoneElectronics; Outside Diameter: 2.54mm; Plating: Silver; Mounting Hole Size: 1mm; Product: TestPoints; Packaging: Bulk; Manufacturer URL: http://www.keyelco.com/; Length: 7.62mm; Datasheet Version: Rev. G, 12/2008; Type: Miniature; Product Category: CircuitBoardHardware-PCB; Material: Nylon; RoHS: True; Contact Material: PhosphorBronze; Datasheet URL: https://ciiva.com/datasheet-click-2917627?src=ciiva&sig=bd195616; Color: White; Brand: KeystoneElectronics
TP18 TP24 TP26 TP29 = CMP-2000-05181-1: Test Point, Black, 1-Pin THD, RoHS, Bulk; Manufacturer: Keystone; Other Names: 5001K; Catalog Drawings: 5000Series; Alternate Color: 5004K-ND / -TESTPOINTPCMINI.040"DYELLOW / 5003K-ND / -TESTPOINTPCMINI.040"DORANGE / 5002K-ND / -TESTPOINTPCMINI.040"DWHITE / 5000K-ND / -TESTPOINTPCMINI.040"DRED; Kits: DKTGRS232C-KIT-ND / -TTLCONVERTER; Online Catalog: ColorCodedTestPoints; Datasheet URL: https://ciiva.com/datasheet-click-2917627?src=ciiva&sig=bd195616; Mounting Type: 0.040"(1.02mm)HoleDiameter; Family: TestPoints; RoHS Information: RoHSComplianceStatement; Datasheet Version: Rev. G, 12/2008; Color: Black; Category: TestandMeasurement; Standard Package: 100; Manufacturer URL: http://www.keyelco.com/; Material: Base,Nylon46,UL94V-0; Type: PCTestPoint,Miniature; Terminal: 0.010"x0.020"(0.25mmx0.51mm)PhosphorBronzeWire,SilverPlated; Series: THM; Packaging: Bulk
U1 = CMP-04918-000139-1: IC REG CHARGE PUMP ADJ DL 12WSON; Switching Frequency: 2.3MHz; Output Current: 250mA; Output Type: Adjustable; Min Output Voltage: 1.5V; Min Input Voltage: 2.7V; Synchronous Rectifier: No; Quiescent Current: 390uA; Max Input Voltage: 5.5V; Max Output Voltage: 5V; Mount: Surface Mount; Lead Free: Lead Free; Topology: Charge Pump; Max Operating Temperature: 85°C; Min Operating Temperature: -40°C; Packaging: Tape and Reel